# EAGLE design Auto2017 (EAGLE 8.2.2)

## Sheet 1 of 3
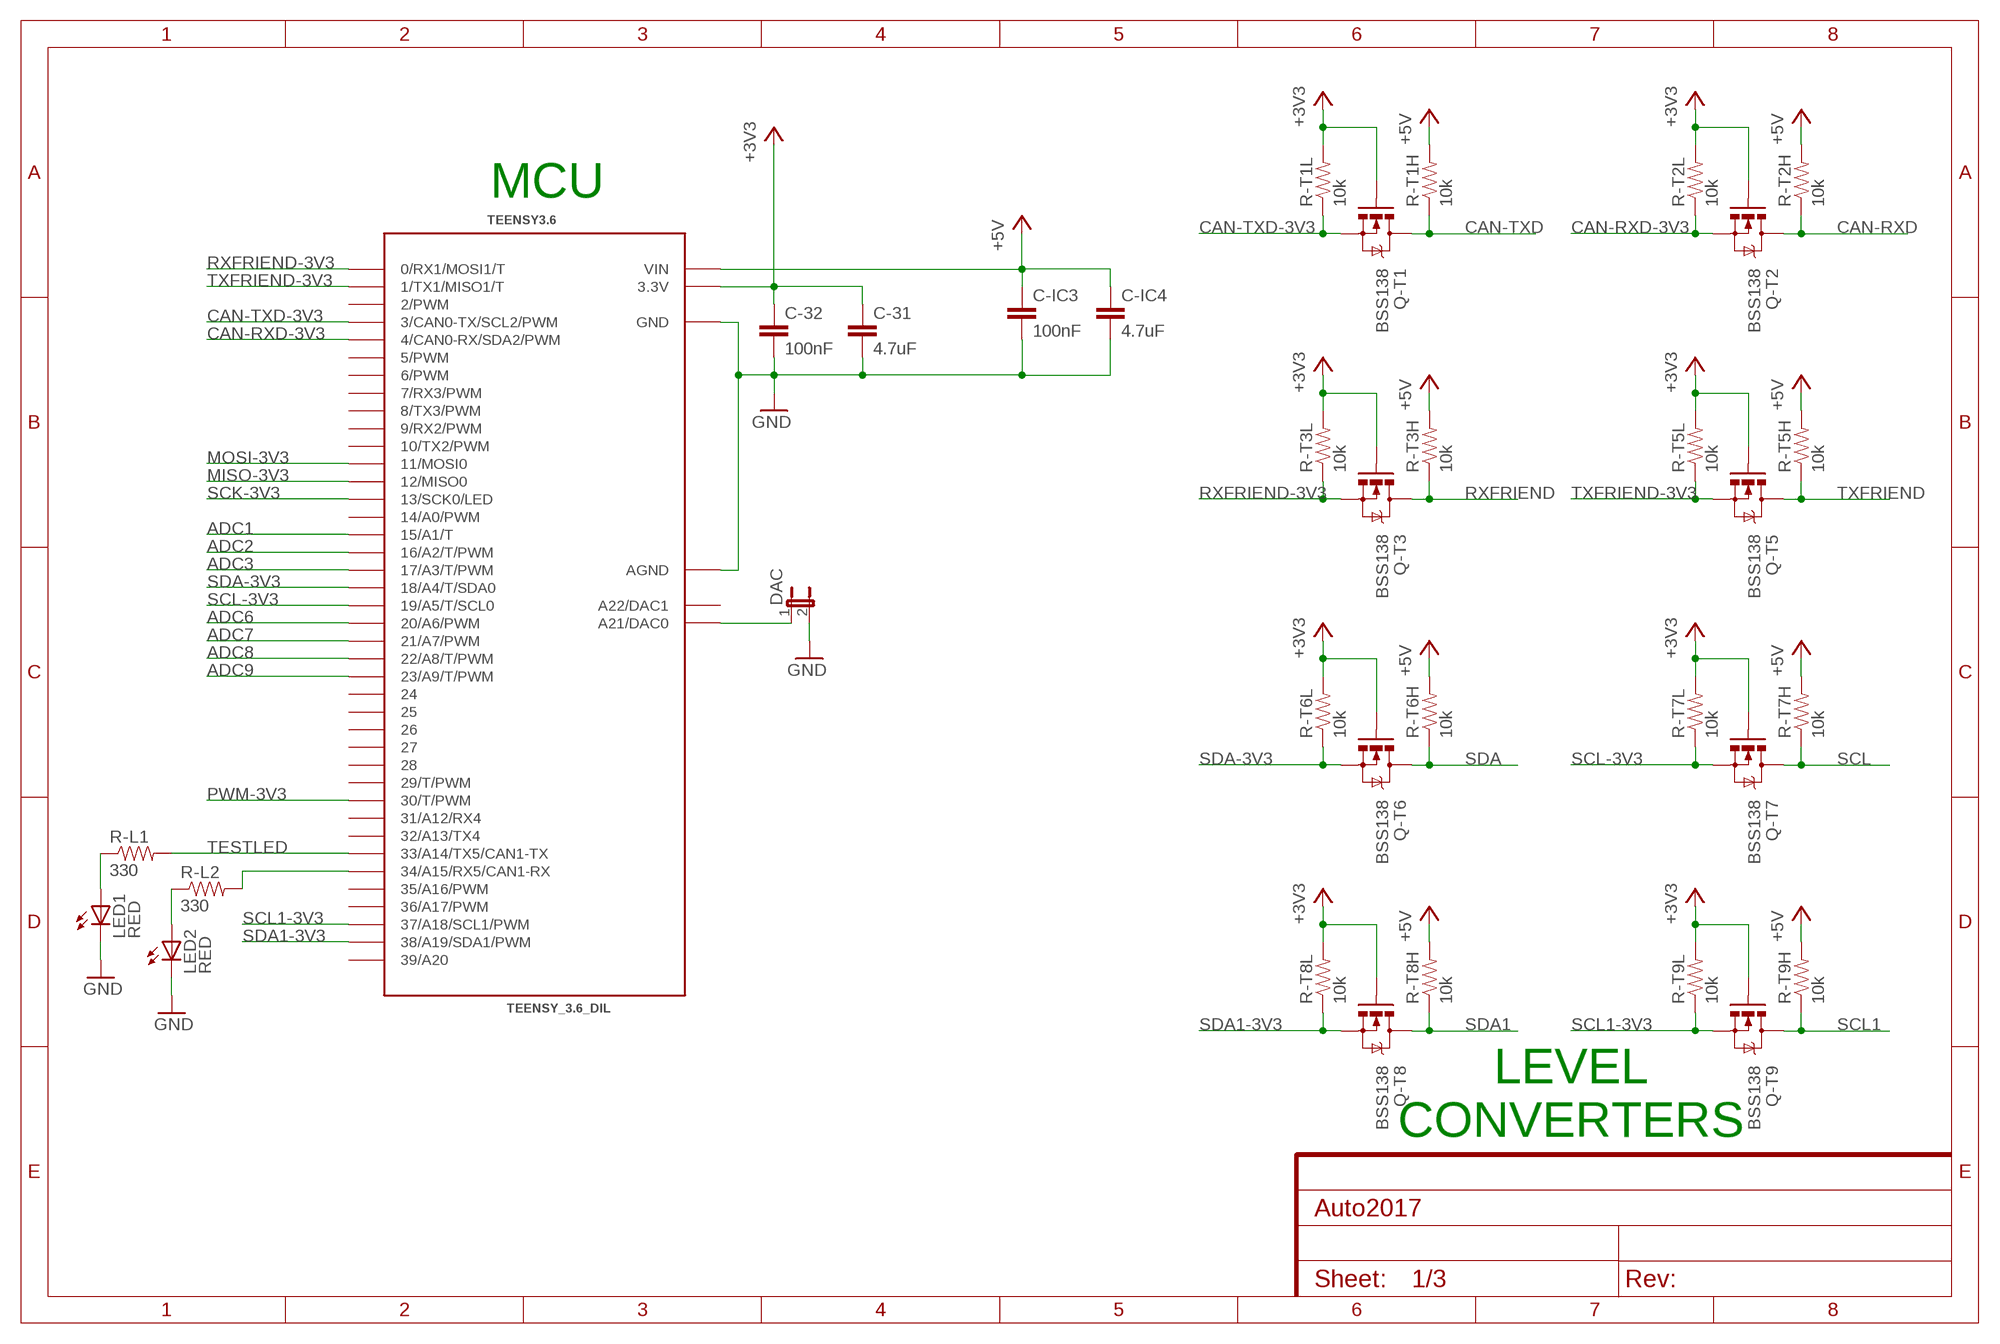
[diagram p0: schematic, sheet 1]
A (FRAME-A4L): CNAME: Auto2017: MCU and Level converters; CREVISION: 2; DESIGNER: Henning

### Parts
C-31  4.7uF  CAP1210  [1210]
C-32  100nF  CAP0805  [0805]
C-IC3  100nF  CAP0805  [0805]
C-IC4  4.7uF  CAP1210  [1210]
DAC  JUMPER-2PTH  [1X02]
LED1  RED  LED1206  [LED-1206]
LED2  RED  LED1206  [LED-1206]
Q-T1  BSS138  MOSFET-NCHANNELBSS123LT1G  [SOT23-3]
Q-T2  BSS138  MOSFET-NCHANNELBSS123LT1G  [SOT23-3]
Q-T3  BSS138  MOSFET-NCHANNELBSS123LT1G  [SOT23-3]
Q-T5  BSS138  MOSFET-NCHANNELBSS123LT1G  [SOT23-3]
Q-T6  BSS138  MOSFET-NCHANNELBSS123LT1G  [SOT23-3]
Q-T7  BSS138  MOSFET-NCHANNELBSS123LT1G  [SOT23-3]
Q-T8  BSS138  MOSFET-NCHANNELBSS123LT1G  [SOT23-3]
Q-T9  BSS138  MOSFET-NCHANNELBSS123LT1G  [SOT23-3]
R-L1  330  RESISTOR0805-RES  [0805]
R-L2  330  RESISTOR0805-RES  [0805]
R-T1H  10k  RESISTOR0805-RES  [0805]
R-T1L  10k  RESISTOR0805-RES  [0805]
R-T2H  10k  RESISTOR0805-RES  [0805]
R-T2L  10k  RESISTOR0805-RES  [0805]
R-T3H  10k  RESISTOR0805-RES  [0805]
R-T3L  10k  RESISTOR0805-RES  [0805]
R-T5H  10k  RESISTOR0805-RES  [0805]
R-T5L  10k  RESISTOR0805-RES  [0805]
R-T6H  10k  RESISTOR0805-RES  [0805]
R-T6L  10k  RESISTOR0805-RES  [0805]
R-T7H  10k  RESISTOR0805-RES  [0805]
R-T7L  10k  RESISTOR0805-RES  [0805]
R-T8H  10k  RESISTOR0805-RES  [0805]
R-T8L  10k  RESISTOR0805-RES  [0805]
R-T9H  10k  RESISTOR0805-RES  [0805]
R-T9L  10k  RESISTOR0805-RES  [0805]
TEENSY3.6  TEENSY_3.6_DIL  [TEENSY_3.6_DIL]

### Nets
+3V3: C-31.1 C-32.1 Q-T1.1(G) Q-T2.1(G) Q-T3.1(G) Q-T5.1(G) Q-T6.1(G) Q-T7.1(G) Q-T8.1(G) Q-T9.1(G) R-T1L.2 R-T2L.2 R-T3L.2 R-T5L.2 R-T6L.2 R-T7L.2 R-T8L.2 R-T9L.2 TEENSY3.6.3.3V TEENSY3.6.3.3V3(3.3V) ; also sheet 3
+5V: C-IC3.1 C-IC4.1 R-T1H.2 R-T2H.2 R-T3H.2 R-T5H.2 R-T6H.2 R-T7H.2 R-T8H.2 R-T9H.2 TEENSY3.6.VIN ; also sheet 2,3
ADC1: TEENSY3.6.15/A1(15/A1/T) ; also sheet 3
ADC2: TEENSY3.6.16/A2(16/A2/T/PWM) ; also sheet 3
ADC3: TEENSY3.6.17/A3(17/A3/T/PWM) ; also sheet 3
ADC6: TEENSY3.6.20/A6(20/A6/PWM) ; also sheet 3
ADC7: TEENSY3.6.21/A7(21/A7/PWM) ; also sheet 3
ADC8: TEENSY3.6.22/A8(22/A8/T/PWM) ; also sheet 3
ADC9: TEENSY3.6.23/A9(23/A9/T/PWM) ; also sheet 3
CAN-RXD: Q-T2.3(D) R-T2H.1 ; also sheet 2
CAN-RXD-3V3: Q-T2.2(S) R-T2L.1 TEENSY3.6.4(4/CAN0-RX/SDA2/PWM)
CAN-TXD: Q-T1.3(D) R-T1H.1 ; also sheet 2
CAN-TXD-3V3: Q-T1.2(S) R-T1L.1 TEENSY3.6.3(3/CAN0-TX/SCL2/PWM)
GND: C-31.2 C-32.2 C-IC3.2 C-IC4.2 DAC.2 LED1.C LED2.C TEENSY3.6.AGND TEENSY3.6.GND TEENSY3.6.GND1(GND) ; also sheet 2,3
MISO-3V3: TEENSY3.6.12(12/MISO0) ; also sheet 3
MOSI-3V3: TEENSY3.6.11(11/MOSI0) ; also sheet 3
N$1: LED1.A R-L1.1
N$2: LED2.A R-L2.1
N$4: R-L2.2 TEENSY3.6.34/A15(34/A15/RX5/CAN1-RX)
N$5: DAC.1 TEENSY3.6.A21(A21/DAC0)
PWM-3V3: TEENSY3.6.30(30/T/PWM) ; also sheet 3
RXFRIEND: Q-T3.3(D) R-T3H.1 ; also sheet 2
RXFRIEND-3V3: Q-T3.2(S) R-T3L.1 TEENSY3.6.0(0/RX1/MOSI1/T)
SCK-3V3: TEENSY3.6.13(13/SCK0/LED) ; also sheet 3
SCL: Q-T7.3(D) R-T7H.1 ; also sheet 2,3
SCL1: Q-T9.3(D) R-T9H.1 ; also sheet 3
SCL1-3V3: Q-T9.2(S) R-T9L.1 TEENSY3.6.37/A18(37/A18/SCL1/PWM)
SCL-3V3: Q-T7.2(S) R-T7L.1 TEENSY3.6.19/A5(19/A5/T/SCL0)
SDA: Q-T6.3(D) R-T6H.1 ; also sheet 2,3
SDA1: Q-T8.3(D) R-T8H.1 ; also sheet 3
SDA1-3V3: Q-T8.2(S) R-T8L.1 TEENSY3.6.38/A19(38/A19/SDA1/PWM)
SDA-3V3: Q-T6.2(S) R-T6L.1 TEENSY3.6.18/A4(18/A4/T/SDA0)
TESTLED: R-L1.2 TEENSY3.6.33/A14(33/A14/TX5/CAN1-TX)
TXFRIEND: Q-T5.3(D) R-T5H.1 ; also sheet 2
TXFRIEND-3V3: Q-T5.2(S) R-T5L.1 TEENSY3.6.1(1/TX1/MISO1/T)
Unconnected: TEENSY3.6.2(2/PWM) TEENSY3.6.5(5/PWM) TEENSY3.6.6(6/PWM) TEENSY3.6.7(7/RX3/PWM) TEENSY3.6.8(8/TX3/PWM) TEENSY3.6.9(9/RX2/PWM) TEENSY3.6.10(10/TX2/PWM) TEENSY3.6.14/A0(14/A0/PWM) TEENSY3.6.24 TEENSY3.6.25 TEENSY3.6.26 TEENSY3.6.27 TEENSY3.6.28 TEENSY3.6.29(29/T/PWM) TEENSY3.6.31/A12(31/A12/RX4) TEENSY3.6.32/A13(32/A13/TX4) TEENSY3.6.35/A16(35/A16/PWM) TEENSY3.6.36/A17(36/A17/PWM) TEENSY3.6.39/A20 TEENSY3.6.A22(A22/DAC1)

### Notes on the sheet
- MCU
- LEVEL
  CONVERTERS

## Sheet 2 of 3
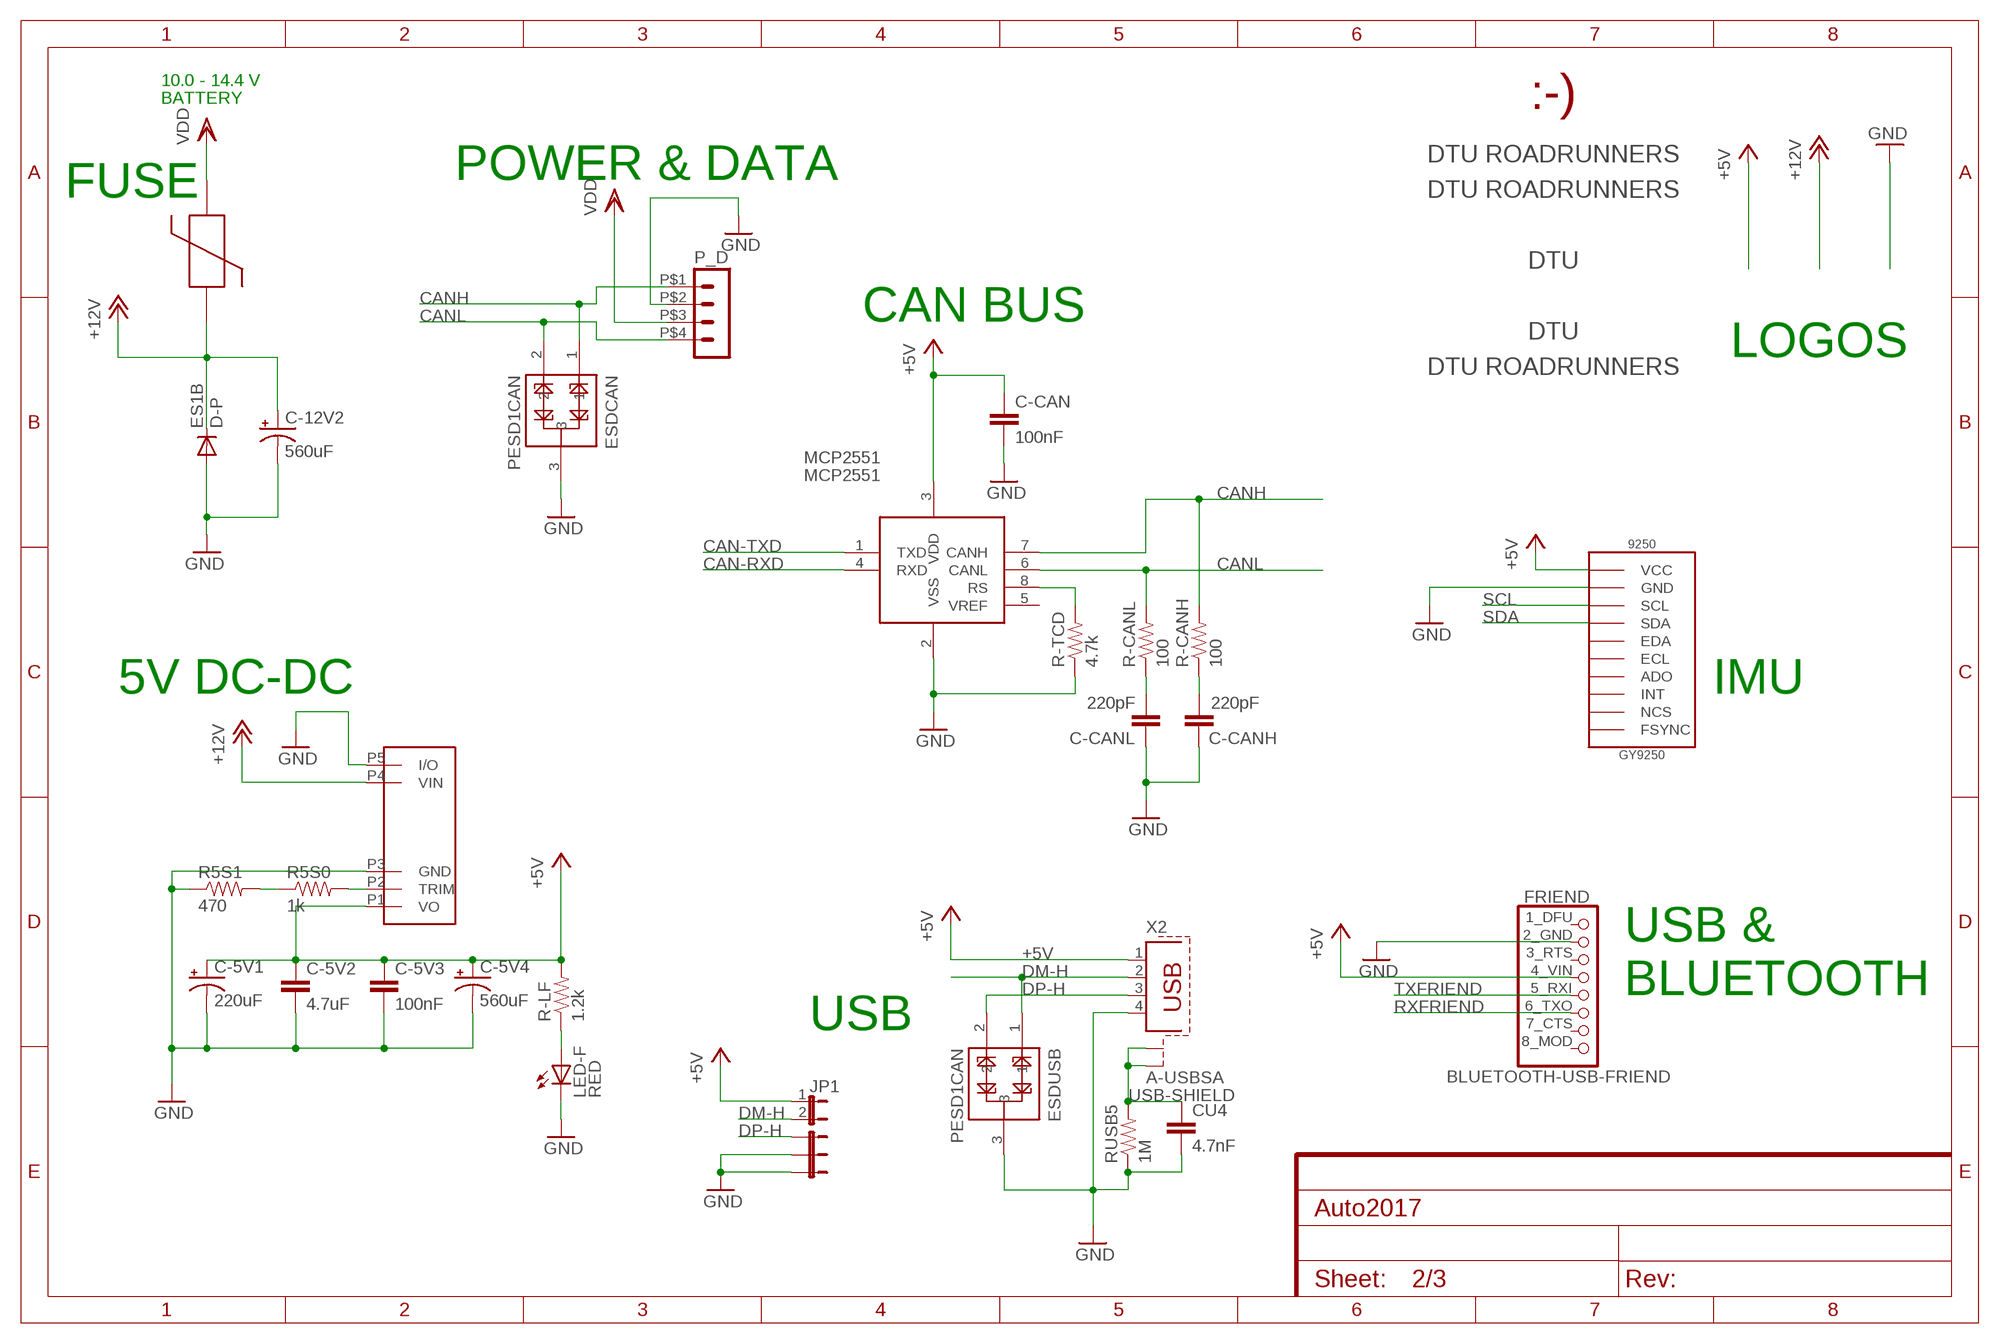
[diagram p1: schematic, sheet 2]
FRAME2 (FRAME-A4L): CNAME: Auto2017: Active components; CREVISION: 2; DESIGNER: Henning

### Parts
9250  GY9250  [GY9250]
C-5V1  220uF  CPOL-USD  [PANASONIC_D]
C-5V2  4.7uF  CAP1210  [1210]
C-5V3  100nF  CAP0805  [0805]
C-5V4  560uF  CPOL-USG  [PANASONIC_G]
C-12V2  560uF  CPOL-USG  [PANASONIC_G]
C-CAN  100nF  CAP0805  [0805]
C-CANH  220pF  CAP0805  [0805]
C-CANL  220pF  CAP0805  [0805]
CU4  4.7nF  CAP0805  [0805]
D-P  ES1B  DIODESMA  [SMA-DIODE]
ESDCAN  PESD1CAN  [SOT23-3]
ESDUSB  PESD1CAN  [SOT23-3]
FRIEND  BLUETOOTH-USB-FRIEND  [1X08_ROUND_76]
JP1  JUMPER-2PTH  [1X02]
JP3  JUMPER-3PTH  [1X03]
LED-F  RED  LED1206  [LED-1206]
MAIN_FUSE  SMF_OMNI-BLOK_FUSE_BLOCK  [SMF_OMNI-BLOK_FUSE_BLOCK]
MCP2551  MCP2551  [SO-08M]
P_D  HEADER_POS4_43045-0401  [43045-0400]
R5S0  1k  RESISTOR0805-RES  [0805]
R5S1  470  RESISTOR0805-RES  [0805]
R-CANH  100  RESISTOR0805-RES  [0805]
R-CANL  100  RESISTOR0805-RES  [0805]
R-LF  1.2k  RESISTOR0805-RES  [0805]
R-TCD  4.7k  RESISTOR0805-RES  [0805]
RUSB5  1M  RESISTOR0805-RES  [0805]
U$1  AXA003A0XZ  [SIP]
U$3  DTUMEDIUM-9MM  [DTU-MEDIUM-9MM]
U$4  ROADRUNNERSFULL  [ROADRUNNERS-FULL]
U$5  ROADRUNNERSSMALL  [ROADRUNNERS-SMALL]
U$6  SMILEY  [SMILEY]
U$8  DTUSMALL  [DTU-SMALL-5MM]
U$9  ROADRUNNERSFULL  [ROADRUNNERS-FULL]
X2  A-USBSA  [USB-A]

### Nets
+5V: 9250.P$VCC(VCC) C-5V1.+ C-5V2.1 C-5V3.1 C-5V4.+ C-CAN.1 FRIEND.4_VIN JP1.1 MCP2551.3(VDD) R-LF.2 U$1.P1(VO) X2.1 ; also sheet 1,3
+12V: C-12V2.+ D-P.C MAIN_FUSE.PIN1 U$1.P4(VIN)
CAN-RXD: MCP2551.4(RXD) ; also sheet 1
CAN-TXD: MCP2551.1(TXD) ; also sheet 1
CANH: ESDCAN.1 MCP2551.7(CANH) P_D.P$1 R-CANH.2
CANL: ESDCAN.2 MCP2551.6(CANL) P_D.P$4 R-CANL.2
DM-H: ESDUSB.1 JP1.2 X2.2
DP-H: ESDUSB.2 JP3.1 X2.3
GND: 9250.P$GND(GND) C-5V1.- C-5V2.2 C-5V3.2 C-5V4.- C-12V2.- C-CAN.2 C-CANH.1 C-CANL.1 CU4.2 D-P.A ESDCAN.3 ESDUSB.3 FRIEND.2_GND JP3.2 JP3.3 LED-F.C MCP2551.2(VSS) P_D.P$2 R5S1.1 R-TCD.1 RUSB5.1 U$1.P3(GND) U$1.P5(I/O) X2.4 ; also sheet 1,3
N$3: R5S0.1 R5S1.2
N$6: R5S0.2 U$1.P2(TRIM)
N$12: LED-F.A R-LF.1
N$25: C-CANL.2 R-CANL.1
N$26: C-CANH.2 R-CANH.1
RS: MCP2551.8(RS) R-TCD.2
RXFRIEND: FRIEND.6_TXO ; also sheet 1
SCL: 9250.P$SCL(SCL) ; also sheet 1,3
SDA: 9250.P$SDA(SDA) ; also sheet 1,3
TXFRIEND: FRIEND.5_RXI ; also sheet 1
USB-SHIELD: CU4.1 RUSB5.2 X2.S1 X2.S2
VDD: MAIN_FUSE.PIN2 P_D.P$3
Unconnected: 9250.P$ADO(ADO) 9250.P$ECL(ECL) 9250.P$EDA(EDA) 9250.P$FSYNC(FSYNC) 9250.P$INT(INT) 9250.P$NCS(NCS) FRIEND.1_DFU FRIEND.3_RTS FRIEND.7_CTS FRIEND.8_MOD MCP2551.5(VREF)

### Notes on the sheet
- 10.0 - 14.4 V
- BATTERY
- POWER & DATA
- FUSE
- CAN BUS
- LOGOS
- 5V DC-DC | IMU
- USB &
  BLUETOOTH
- USB

## Sheet 3 of 3
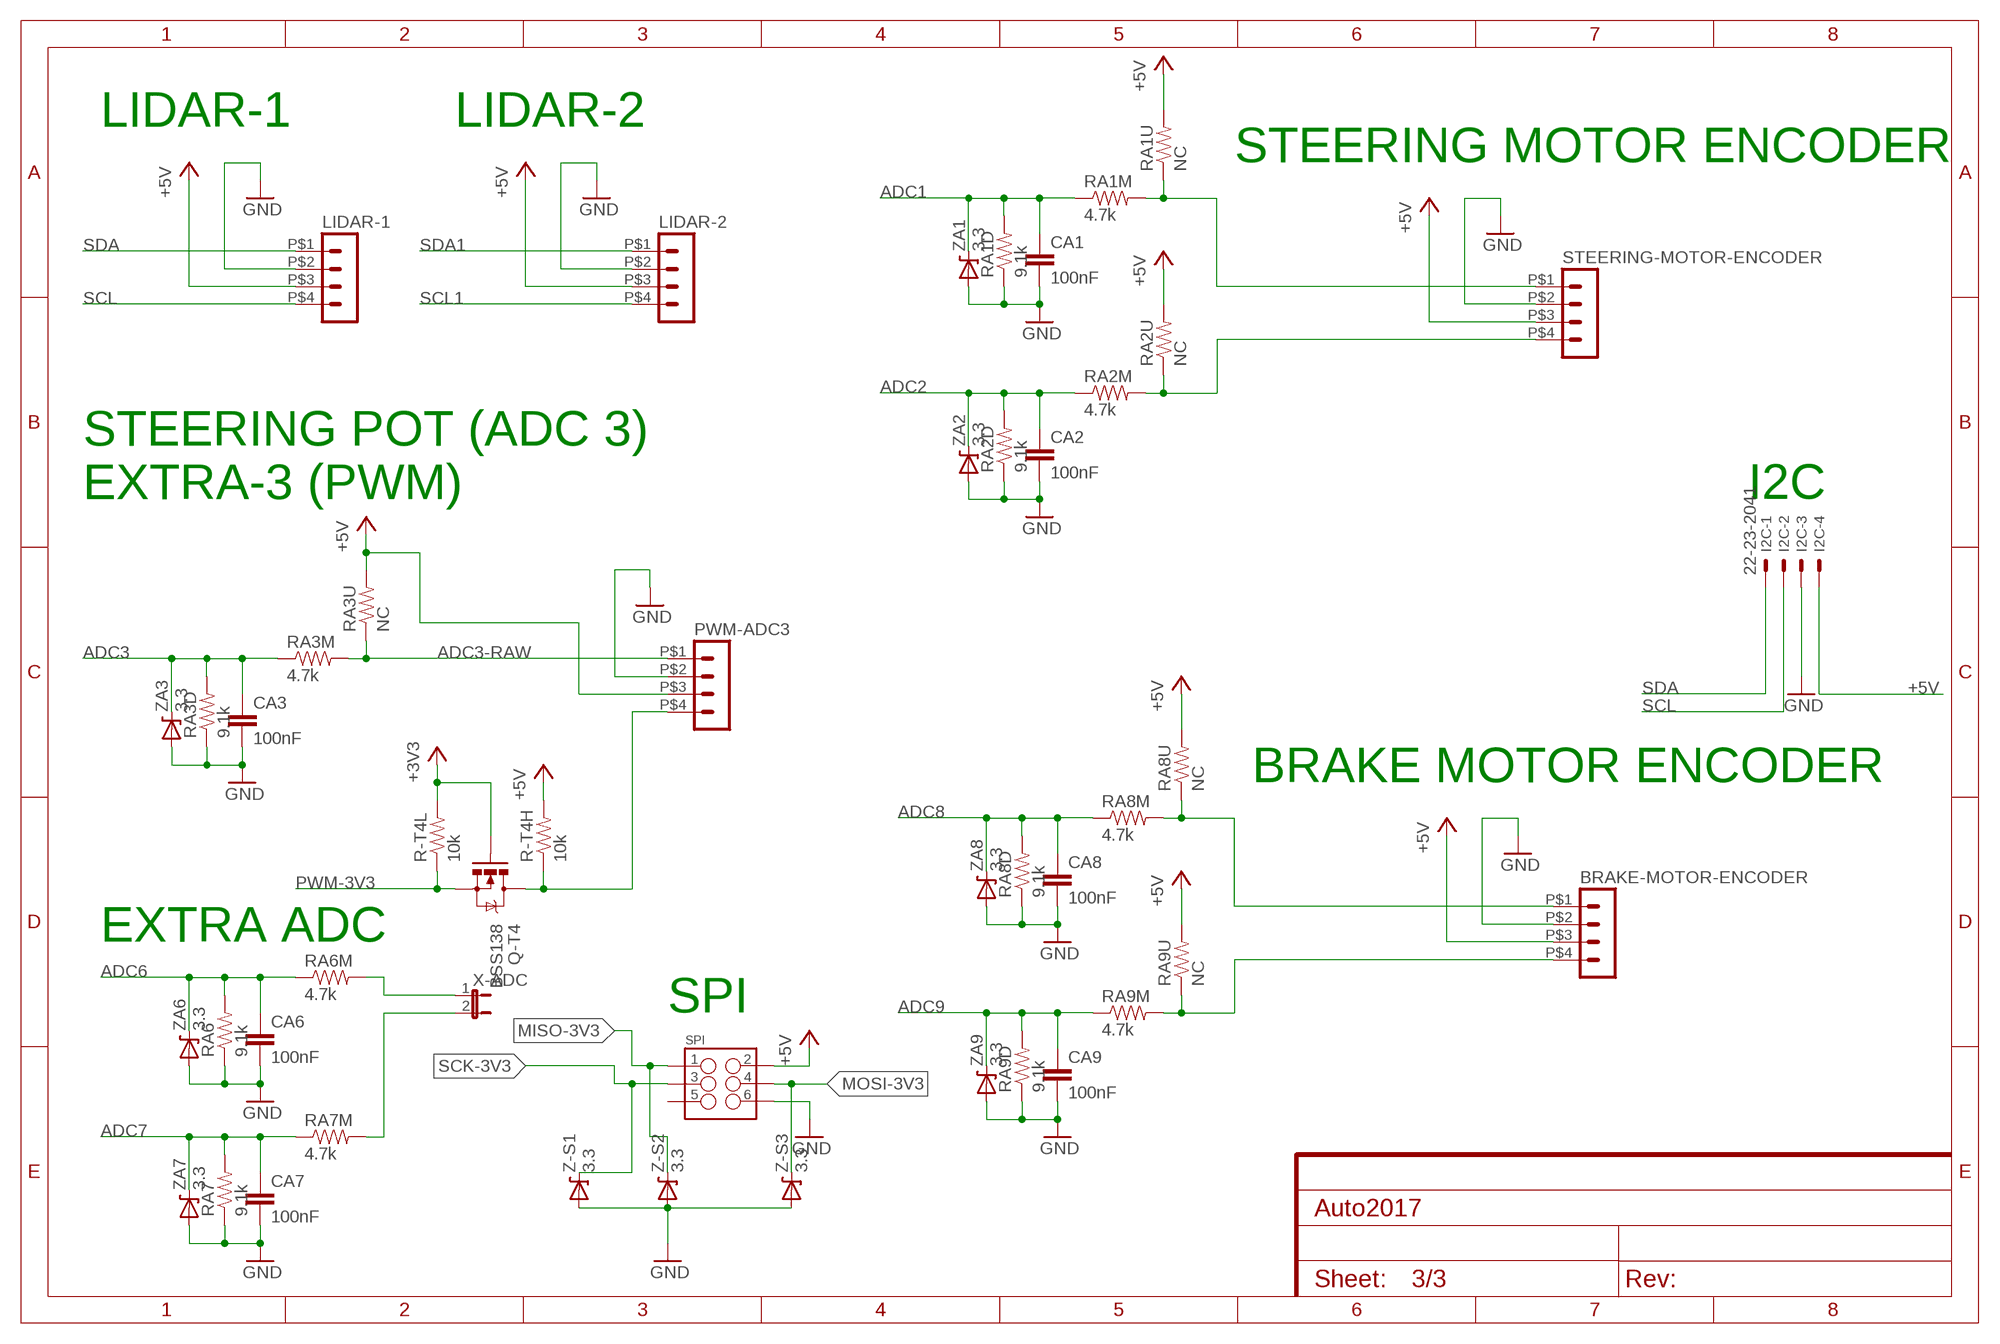
[diagram p2: schematic, sheet 3]
FRAME1 (FRAME-A4L): CNAME: Auto2017: External connections; CREVISION: 2; DESIGNER: Henning

### Parts
BRAKE-MOTOR-ENCODER  HEADER_POS4_43045-0401  [43045-0400]
CA1  100nF  CAP0805  [0805]
CA2  100nF  CAP0805  [0805]
CA3  100nF  CAP0805  [0805]
CA6  100nF  CAP0805  [0805]
CA7  100nF  CAP0805  [0805]
CA8  100nF  CAP0805  [0805]
CA9  100nF  CAP0805  [0805]
I2C  22-23-2041  [22-23-2041]
LIDAR-1  HEADER_POS4_43045-0401  [43045-0400]
LIDAR-2  HEADER_POS4_43045-0401  [43045-0400]
PWM-ADC3  HEADER_POS4_43045-0401  [43045-0400]
Q-T4  BSS138  MOSFET-NCHANNELBSS123LT1G  [SOT23-3]
R-T4H  10k  RESISTOR0805-RES  [0805]
R-T4L  10k  RESISTOR0805-RES  [0805]
RA1D  9.1k  RESISTOR0805-RES  [0805]
RA1M  4.7k  RESISTOR0805-RES  [0805]
RA1U  NC  RESISTOR0805-RES  [0805]
RA2D  9.1k  RESISTOR0805-RES  [0805]
RA2M  4.7k  RESISTOR0805-RES  [0805]
RA2U  NC  RESISTOR0805-RES  [0805]
RA3D  9.1k  RESISTOR0805-RES  [0805]
RA3M  4.7k  RESISTOR0805-RES  [0805]
RA3U  NC  RESISTOR0805-RES  [0805]
RA6  9.1k  RESISTOR0805-RES  [0805]
RA6M  4.7k  RESISTOR0805-RES  [0805]
RA7  9.1k  RESISTOR0805-RES  [0805]
RA7M  4.7k  RESISTOR0805-RES  [0805]
RA8D  9.1k  RESISTOR0805-RES  [0805]
RA8M  4.7k  RESISTOR0805-RES  [0805]
RA8U  NC  RESISTOR0805-RES  [0805]
RA9D  9.1k  RESISTOR0805-RES  [0805]
RA9M  4.7k  RESISTOR0805-RES  [0805]
RA9U  NC  RESISTOR0805-RES  [0805]
SPI  M03X2POGO_PINS  [2X3_POGO]
STEERING-MOTOR-ENCODER  HEADER_POS4_43045-0401  [43045-0400]
X-ADC  JUMPER-2PTH  [1X02]
Z-S1  3.3  ZENER  [SOD123]
Z-S2  3.3  ZENER  [SOD123]
Z-S3  3.3  ZENER  [SOD123]
ZA1  3.3  ZENER  [SOD123]
ZA2  3.3  ZENER  [SOD123]
ZA3  3.3  ZENER  [SOD123]
ZA6  3.3  ZENER  [SOD123]
ZA7  3.3  ZENER  [SOD123]
ZA8  3.3  ZENER  [SOD123]
ZA9  3.3  ZENER  [SOD123]

### Nets
+3V3: Q-T4.1(G) R-T4L.2 ; also sheet 1
+5V: BRAKE-MOTOR-ENCODER.P$3 I2C.4 LIDAR-1.P$3 LIDAR-2.P$3 PWM-ADC3.P$3 R-T4H.2 RA1U.2 RA2U.2 RA3U.2 RA8U.2 RA9U.2 SPI.P$2 STEERING-MOTOR-ENCODER.P$3 ; also sheet 1,2
ADC1: CA1.1 RA1D.2 RA1M.1 ZA1.C ; also sheet 1
ADC1-RAW: RA1M.2 RA1U.1 STEERING-MOTOR-ENCODER.P$1
ADC2: CA2.1 RA2D.2 RA2M.1 ZA2.C ; also sheet 1
ADC2-RAW: RA2M.2 RA2U.1 STEERING-MOTOR-ENCODER.P$4
ADC3: CA3.1 RA3D.2 RA3M.1 ZA3.C ; also sheet 1
ADC3-RAW: PWM-ADC3.P$1 RA3M.2 RA3U.1
ADC6: CA6.1 RA6.2 RA6M.1 ZA6.C ; also sheet 1
ADC6-RAW: RA6M.2 X-ADC.1
ADC7: CA7.1 RA7.2 RA7M.1 ZA7.C ; also sheet 1
ADC7-RAW: RA7M.2 X-ADC.2
ADC8: CA8.1 RA8D.2 RA8M.1 ZA8.C ; also sheet 1
ADC8-RAW: BRAKE-MOTOR-ENCODER.P$1 RA8M.2 RA8U.1
ADC9: CA9.1 RA9D.2 RA9M.1 ZA9.C ; also sheet 1
ADC9-RAW: BRAKE-MOTOR-ENCODER.P$4 RA9M.2 RA9U.1
GND: BRAKE-MOTOR-ENCODER.P$2 CA1.2 CA2.2 CA3.2 CA6.2 CA7.2 CA8.2 CA9.2 I2C.3 LIDAR-1.P$2 LIDAR-2.P$2 PWM-ADC3.P$2 RA1D.1 RA2D.1 RA3D.1 RA6.1 RA7.1 RA8D.1 RA9D.1 SPI.P$6 STEERING-MOTOR-ENCODER.P$2 Z-S1.A Z-S2.A Z-S3.A ZA1.A ZA2.A ZA3.A ZA6.A ZA7.A ZA8.A ZA9.A ; also sheet 1,2
MISO-3V3: SPI.P$1 Z-S2.C ; also sheet 1
MOSI-3V3: SPI.P$4 Z-S3.C ; also sheet 1
PWM-3V3: Q-T4.2(S) R-T4L.1 ; also sheet 1
PWM-5V: PWM-ADC3.P$4 Q-T4.3(D) R-T4H.1
SCK-3V3: SPI.P$3 Z-S1.C ; also sheet 1
SCL: I2C.2 LIDAR-1.P$4 ; also sheet 1,2
SCL1: LIDAR-2.P$4 ; also sheet 1
SDA: I2C.1 LIDAR-1.P$1 ; also sheet 1,2
SDA1: LIDAR-2.P$1 ; also sheet 1
Unconnected: SPI.P$5

### Notes on the sheet
- LIDAR-1 | LIDAR-2
- STEERING MOTOR ENCODER
- STEERING POT (ADC 3)
  EXTRA-3 (PWM)
- I2C
- BRAKE MOTOR ENCODER
- EXTRA ADC
- SPI

## Library data of the parts
9250 = GY9250:GY9250: GY9250/6500 MPU-9250 module (3 axis accelerator, 3 axis gyro and 3 axis magnetometer) Chip: MPU9250; Power voltage: 3~5V Communication mode: I2C / SPI; Gyro range: +/-250, +/-500, +/-1000, +/-2000dps Accelerator range: +/-2G, +/-4G, +/-8G, +/-16G Magnetometer range: +/-4800uF Pin spacing: 2.54mm Bought from AliExpress <https://www.aliexpress.com/item/SPI-IIC-MPU-9250-9-Axis-Attitude-Gyro-Accelerator-Magnetometer-Sensor-Module/1893522629.html>
BRAKE-MOTOR-ENCODER LIDAR-1 LIDAR-2 P_D PWM-ADC3 STEERING-MOTOR-ENCODER = con-molex-micro-fit-3_0:HEADER_POS4_?: Molex - Micro-Fit 3.0 Series connector, 3.00mm (0.118") pitch header, 4 positions.
C-5V1 C-5V4 C-12V2 = rcl:CPOL-US: POLARIZED CAPACITOR, American symbol
C-5V2 C-5V3 C-31 C-32 C-CAN C-CANH C-CANL C-IC3 C-IC4 CA1-CA3 CA6-CA9 CU4 = SparkFun-Passives:CAP: Capacitor Standard 0603 ceramic capacitor, and 0.1" leaded capacitor.
D-P = SparkFun-DiscreteSemi:DIODE: Diode These are standard reverse protection diodes and small signal diodes. SMA package can handle up to about 1A. SOD-323 can handle about 200mA. What the SOD-323 package when ordering, there are some mfgs out there that are 5-pin packages.
DAC JP1 X-ADC = SparkFun-Retired:JUMPER-2: Jumper Basic 0.1" spaced jumper. Use with breakaway headers.
ESDCAN ESDUSB = SparkFun-DiscreteSemi:PESD1CAN: PESD1CAN is used to protect two automotive CAN bus lines from ESD.; PROD_ID: DIO-12501
FRIEND = BluetoothAndUSBFriend:BLUETOOTH-USB-FRIEND
I2C = con-molex:22-23-2041: .100" (2.54mm) Center Header - 4 Pin; MF: MOLEX; MPN: 22-23-2041; OC_FARNELL: 1462920; OC_NEWARK: 38C0355
JP3 = SparkFun-Retired:JUMPER-3
LED1 LED2 LED-F = SparkFun-LED:LED: LEDs Standard schematic elements and footprints for 5mm, 3mm, 1206, and 0603 sized LEDs. 5mm - Spark Fun Electronics SKU : COM-00529 (and others)
MAIN_FUSE = SMF_OMNI-BLOK_FUSE_BLOCK:SMF_OMNI-BLOK_FUSE_BLOCK
MCP2551 = skpang_lib:MCP2551
Q-T1-Q-T9 = SparkFun-DiscreteSemi:MOSFET-NCHANNEL: Common NMOSFET Parts MFG P/N Store ID Prod ID FDD8780 TRANS-09984 SI7820DN TRANS-11055 FDS6630A IC-08089 2N7002PW TRANS-11151 FQP30N06L COM-10213 TRANS-10060 BSS123LT1G TRANS-08345 BSS138 TRANS-00830 BS170 2N7000; PROD_ID: TRANS-08345
R5S0 R5S1 R-CANH R-CANL R-L1 R-L2 R-LF R-T1H R-T1L R-T2H R-T2L R-T3H R-T3L R-T4H R-T4L R-T5H R-T5L R-T6H R-T6L R-T7H R-T7L R-T8H R-T8L R-T9H R-T9L R-TCD RA1D RA1M RA1U RA2D RA2M RA2U RA3D RA3M RA3U RA6 RA6M RA7 RA7M RA8D RA8M RA8U RA9D RA9M RA9U RUSB5 = SparkFun-Resistors:RESISTOR: Resistor Basic schematic elements and footprints for 0603, 1206, and PTH resistors.
SPI = SparkFun-Connectors:M03X2: 2x3 .1" header. Shrouded, with keying- CONN-10681 SMT- CONN-11415 Pogo pins- HW-11044; PROD_ID: HW-11044
TEENSY3.6 = Teensy_3_and_LC_Series_Boards_v1.4:TEENSY_3.6_DIL: Teensy 3.6 DIL Package
U$1 = Austin-MiniLynx-DC-DC:AXA003A0XZ: Lineage Power Austin MiniLynx DC-DC Ikke-isoleret DC-DC-konverter, Udgang: 0.75 → 5.5V dc, Udgangsstrøm: 3A RS-varenummer:152-524 Fabrikant: Lineage Power Producentens varenummer: AXA003A0XZ
U$3 U$8 = Logos:DTU
U$4 U$5 U$9 = Logos:ROADRUNNERS
U$6 = Logos:SMILEY
X2 = AssmannUSB:A-USBSA
Z-S1-Z-S3 ZA1-ZA3 ZA6-ZA9 = diodes:ZENER

## Board
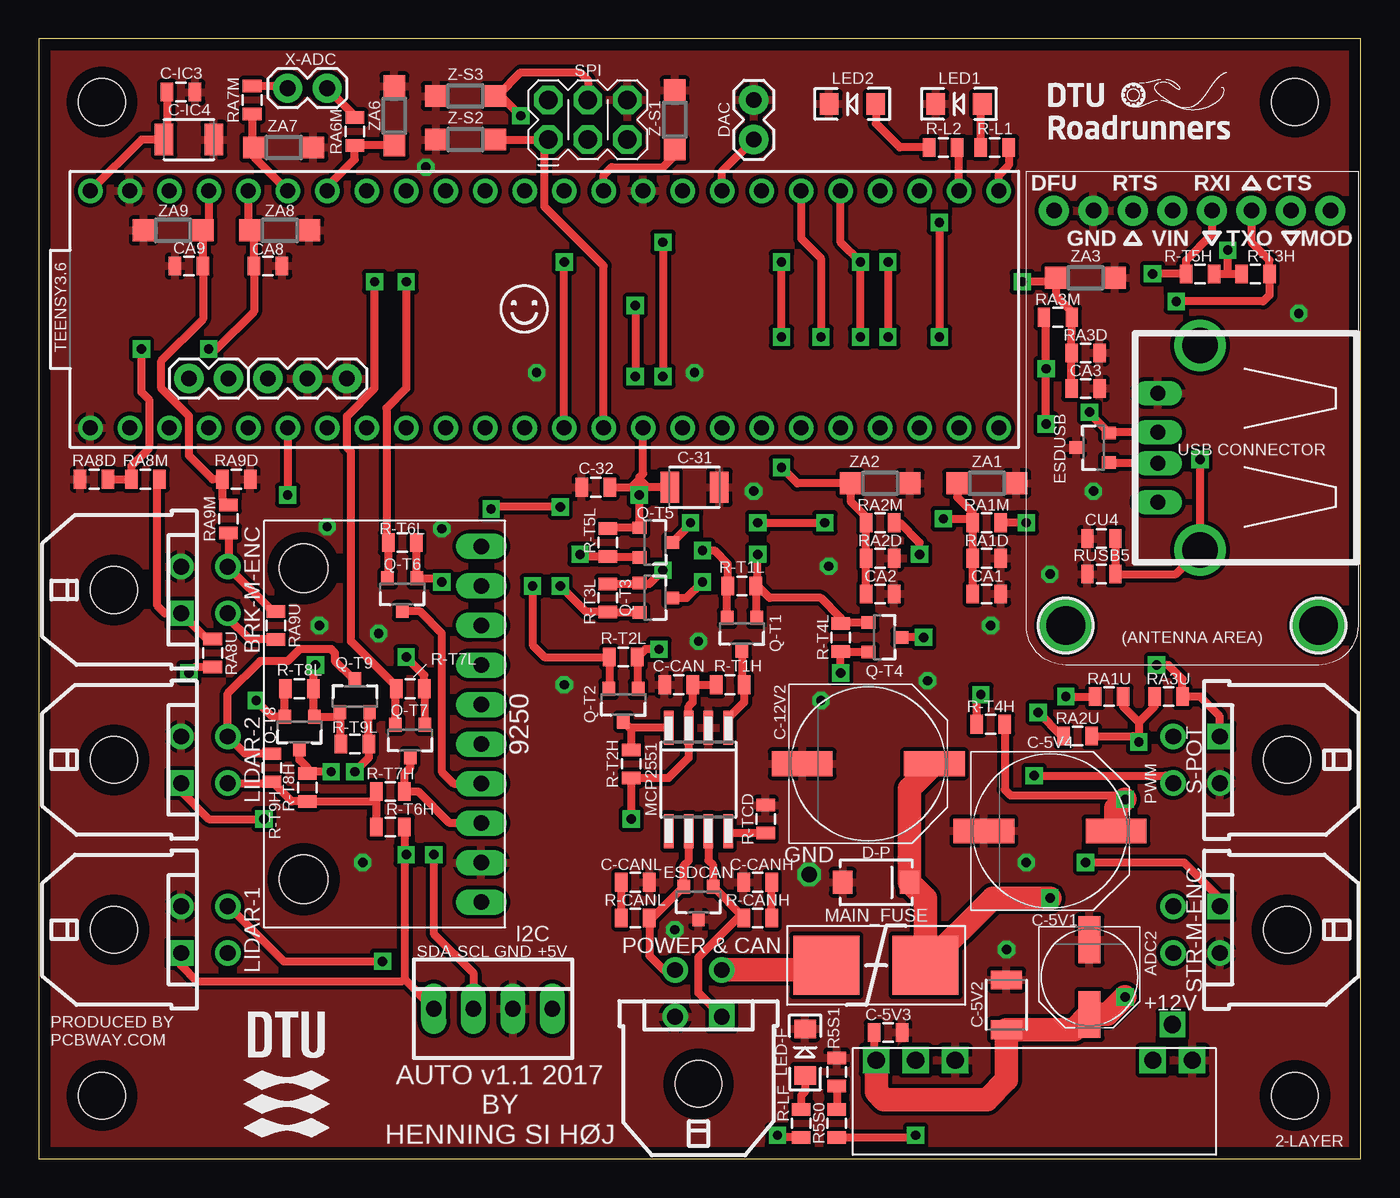
[diagram p3: board, top side]
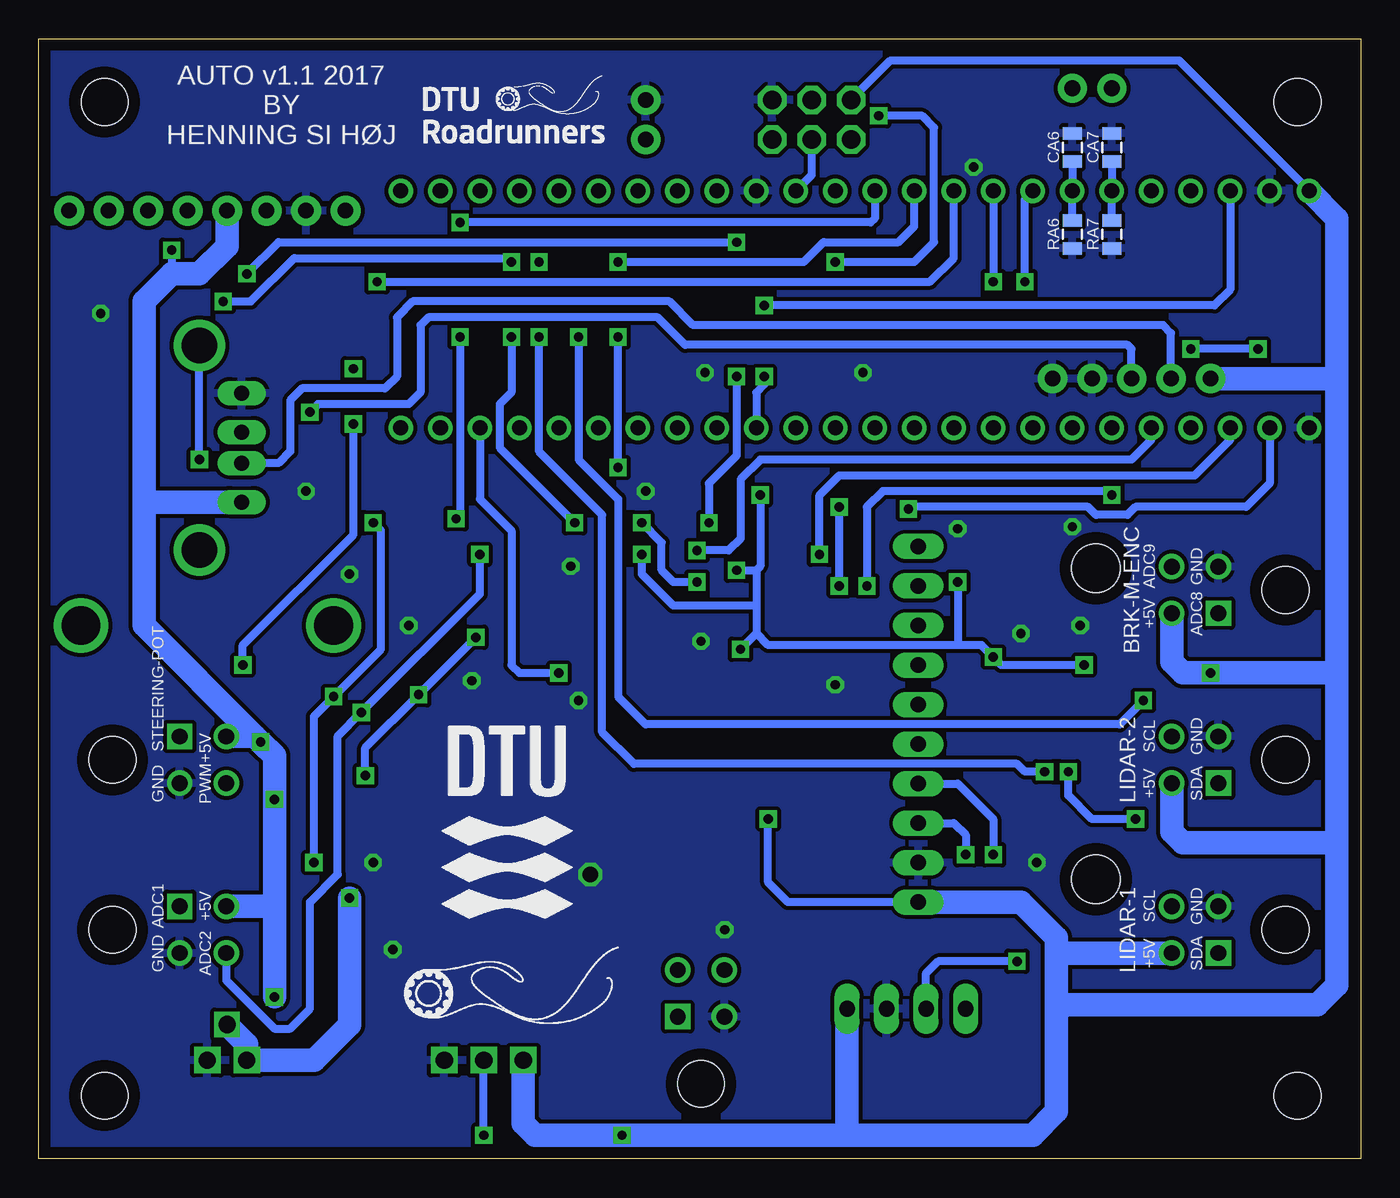
[diagram p4: board, bottom side, seen from below]

Size 85 x 72 mm. Coordinates in mm from the lower left corner, seen from the top.
Outline: 0,0 85,0 85,72 0,72 0,0
Copper layers (1*16): Top 0.035mm / dielectric 1.5mm / Bottom 0.035mm
Design rules "CustomSparkFun2Layer *": minimum track width 16mil, minimum drill 20mil, track to track 10mil, track to pad 8mil, pad to pad 8mil, via to via 8mil, smd to smd 8mil, copper to edge 30mil, drill to drill 8mil, minimum pad ring 12mil, minimum via ring 10mil, stop-mask expansion 4mil, vias tented up to drill 25mil, thermal gap 10mil
Holes 3 mm at 4.06,67.94 80.77,67.94 80.77,4.06 4.06,4.06

### Footprints (pad centres in the part's own frame; a part is rotated, then mirrored left to right if it is on the bottom)
GY9250 = drill 1.016 long: P$ADO 3.81,-6.35; P$ECL -1.27,-6.35; P$EDA 1.27,-6.35; P$FSYNC 11.43,-6.35; P$GND -8.89,-6.35; P$INT 6.35,-6.35; P$NCS 8.89,-6.35; P$SCL -6.35,-6.35; P$SDA -3.81,-6.35; P$VCC -11.43,-6.35 | hole 3.1: -9.97,5.08; 10.03,5.08
43045-0400 = drill 1.02 square: P$1 1.5,4.32 | drill 1.02: P$2 -1.5,4.32; P$3 1.5,7.32; P$4 -1.5,7.32 | hole 3: 0,0
PANASONIC_D = smd 3 x 1.4: + 2.4,0; - -2.4,0
1210 = smd 1.2 x 2: 1 -1.6,0; 2 1.6,0
0805 = smd 0.8 x 1.2: 1 -0.9,0; 2 0.9,0
PANASONIC_G = smd 3.9 x 1.6: + 4.25,0; - -4.25,0
SMA-DIODE = smd 1.27 x 1.47: A -2.15,0; C 2.15,0
1X02 = drill 1.016 pad 1.88: 1 0,0; 2 2.54,0
SOT23-3 = smd 0.8 x 0.9: 1 -0.95,-1; 2 0.95,-1; 3 0,1.1
1X08_ROUND_76 = drill 1 pad 1.93: 1_DFU 19.558,2.54; 2_GND 17.018,2.54; 3_RTS 14.478,2.54; 4_VIN 11.938,2.54; 5_RXI 9.398,2.54; 6_TXO 6.858,2.54; 7_CTS 4.318,2.54; 8_MOD 1.778,2.54 | drill 2.5 pad 3.2: P$1 2.54,29.21; P$2 18.796,29.21
22-23-2041 = drill 1 long: 1 -3.81,0; 2 -1.27,0; 3 1.27,0; 4 3.81,0
1X03 = drill 1.016 pad 1.88: 1 0,0; 2 2.54,0; 3 5.08,0
LED-1206 = smd 1.2 x 1.4: A -1.5,0; C 1.5,0
SMF_OMNI-BLOK_FUSE_BLOCK = smd 4.242 x 3.81: PIN1 -3.175,0; PIN2 3.2,0
SO-08M = smd 0.6 x 2.2: 1 -1.905,-3.33; 2 -0.635,-3.33; 3 0.635,-3.33; 4 1.905,-3.33; 5 1.905,3.33; 6 0.635,3.33; 7 -0.635,3.33; 8 -1.905,3.33
2X3_POGO = drill 1.2 pad 1.829 octagon: P$1 0,0; P$2 0,2.54; P$3 2.54,0; P$4 2.54,2.54; P$5 5.08,0; P$6 5.08,2.54
TEENSY_3.6_DIL = drill 0.965: 0 -7.62,25.4; 1 -7.62,22.86; 2 -7.62,20.32; 3 -7.62,17.78; 3.3V 7.62,22.86; 3.3V3 -7.62,-7.62; 4 -7.62,15.24; 5 -7.62,12.7; 6 -7.62,10.16; 7 -7.62,7.62; 8 -7.62,5.08; 9 -7.62,2.54; 10 -7.62,0; 11 -7.62,-2.54; 12 -7.62,-5.08; 13 7.62,-5.08; 14/A0 7.62,-2.54; 15/A1 7.62,0; 16/A2 7.62,2.54; 17/A3 7.62,5.08; 18/A4 7.62,7.62; 19/A5 7.62,10.16; 20/A6 7.62,12.7; 21/A7 7.62,15.24; 22/A8 7.62,17.78; 23/A9 7.62,20.32; 24 -7.62,-10.16; 25 -7.62,-12.7; 26 -7.62,-15.24; 27 -7.62,-17.78; 28 -7.62,-20.32; 29 -7.62,-22.86; 30 -7.62,-25.4; 31/A12 -7.62,-27.94; 32/A13 -7.62,-30.48; 33/A14 7.62,-30.48; 34/A15 7.62,-27.94; 35/A16 7.62,-25.4; 36/A17 7.62,-22.86; 37/A18 7.62,-20.32; 38/A19 7.62,-17.78; 39/A20 7.62,-15.24; A21 7.62,-12.7; A22 7.62,-10.16; AGND 7.62,25.4; GND -7.62,27.94; GND1 7.62,-7.62; VIN 7.62,27.94
SIP = drill 1.1 pad 1.626 square: P1 10.414,-3.048; P2 7.874,-3.048; P3 5.334,-3.048; P4 -7.366,-3.048; P5 -9.906,-3.048
USB-A = drill 0.95 long: 1 -3.5,2.71; 2 -1,2.71; 3 1,2.71; 4 3.5,2.71 | drill 2.3 pad 2.9: S1 -6.57,0; S2 6.57,0
SOD123 = smd 1.4 x 1.4: A 1.9,0; C -1.9,0

### Placement (x,y rotation side)
9250  22.1,27.94 90 top
BRAKE-MOTOR-ENCODER  4.83,36.58 270 top
C-5V1  67.56,11.68 270 top
C-5V2  62.23,9.91 90 top
C-5V3  54.61,8.13 0 top
C-5V4  65.02,21.08 0 top
C-12V2  53.34,25.4 0 top
C-31  42.16,43.18 0 top
C-32  35.81,43.18 180 top
C-CAN  41.15,30.48 180 top
C-CANH  46.23,17.78 0 top
C-CANL  38.35,17.78 180 top
C-IC3  9.14,68.58 0 top
C-IC4  9.65,65.53 0 top
CA1  60.96,36.32 0 top
CA2  54.1,36.32 0 top
CA3  67.31,49.53 0 top
CA6  18.54,65.02 90 bottom
CA7  16,65.02 90 bottom
CA8  14.73,57.4 0 top
CA9  9.65,57.4 180 top
CU4  68.33,39.88 180 top
D-P  53.85,17.78 0 top
DAC  45.97,65.53 90 top
ESDCAN  42.42,16.51 180 top
ESDUSB  67.82,45.72 90 top
FRIEND  84.84,63.5 180 top
I2C  29.21,9.65 0 top
JP1  9.65,50.16 0 top
JP3  14.73,50.16 0 top
LED1  59.18,67.82 180 top
LED2  52.32,67.82 180 top
LED-F  49.28,6.86 90 top
LIDAR-1  4.83,14.73 270 top
LIDAR-2  4.83,25.65 270 top
MAIN_FUSE  53.85,12.45 180 top
MCP2551  42.42,24.38 180 top
P_D  42.42,4.83 0 top
PWM-ADC3  80.26,25.65 90 top
Q-T1  45.21,33.78 180 top
Q-T2  37.59,29.21 180 top
Q-T3  39.62,36.07 270 top
Q-T4  54.36,33.53 270 top
Q-T5  39.62,39.62 270 top
Q-T6  23.37,36.32 180 top
Q-T7  23.88,26.92 180 top
Q-T8  16.76,27.43 180 top
Q-T9  20.32,29.72 0 top
R5S0  51.31,2.29 270 top
R5S1  51.31,5.59 270 top
R-CANH  46.23,15.49 180 top
R-CANL  38.35,15.49 0 top
R-L1  61.47,65.02 0 top
R-L2  58.17,65.02 0 top
R-LF  49.02,2.29 270 top
R-T1H  44.45,30.48 180 top
R-T1L  45.21,36.83 0 top
R-T2H  38.1,25.4 270 top
R-T2L  37.59,32.26 0 top
R-T3H  78.23,56.9 180 top
R-T3L  36.58,36.07 90 top
R-T4H  61.21,27.94 0 top
R-T4L  51.56,33.53 90 top
R-T5H  74.68,56.9 0 top
R-T5L  36.58,39.62 90 top
R-T6H  22.61,21.34 180 top
R-T6L  23.37,39.62 0 top
R-T7H  22.61,23.62 180 top
R-T7L  23.88,30.23 0 top
R-T8H  17.27,23.88 270 top
R-T8L  16.76,30.23 0 top
R-T9H  14.99,25.15 270 top
R-T9L  20.32,26.67 180 top
R-TCD  46.74,21.84 270 top
RA1D  60.96,38.61 180 top
RA1M  60.96,40.89 0 top
RA1U  68.83,29.72 0 top
RA2D  54.1,38.61 180 top
RA2M  54.1,40.89 0 top
RA2U  66.8,27.18 0 top
RA3D  67.31,51.82 180 top
RA3M  65.53,54.1 180 top
RA3U  72.64,29.72 180 top
RA6  18.54,59.44 90 bottom
RA6M  20.32,66.04 90 top
RA7  16,59.44 90 bottom
RA7M  13.72,68.07 90 top
RA8D  3.56,43.69 0 top
RA8M  6.86,43.69 0 top
RA8U  11.18,32.51 270 top
RA9D  12.7,43.69 180 top
RA9M  12.19,41.15 270 top
RA9U  15.24,34.29 270 top
RUSB5  68.33,37.59 0 top
SPI  32.77,65.53 0 top
STEERING-MOTOR-ENCODER  80.26,14.73 90 top
TEENSY3.6  31.24,54.61 90 top
U$1  64.26,3.3 180 top
U$3  54.86,22.35 0 bottom
U$4  70.87,67.82 0 top
U$5  54.61,11.18 0 bottom
U$6  31.24,54.61 0 top
U$8  16,6.1 0 top
U$9  54.36,67.56 0 bottom
X2  74.68,45.72 90 top
X-ADC  18.54,68.83 180 top
Z-S1  40.89,66.8 90 top
Z-S2  27.43,65.53 180 top
Z-S3  27.43,68.33 180 top
ZA1  60.96,43.43 0 top
ZA2  54.1,43.43 0 top
ZA3  67.31,56.64 0 top
ZA6  22.86,67.06 90 top
ZA7  15.75,65.02 0 top
ZA8  15.49,59.69 0 top
ZA9  8.64,59.69 180 top

### Tracks (layer width: path | path; a pad name or v marks a point on that pad's centre or on a via)
+3V3  (via drill 0.6)
  Top 0.508: Q-T7.1 24.83,30.18 R-T7L.2 24.78,31.1 v23.62,32.26 | Q-T2.1 38.49,30.26 R-T2L.2 39,32.77 v39.88,32.77 | 36.63,37.02 R-T3L.2 38.61,36.97 | R-T5L.2 36.63,40.57 Q-T5.1 38.62,42.15 | 38.62,43.69 38.62,43.82 38.86,44.06 TEENSY3.6.3.3V3 | Q-T1.1 46.16,36.78 | 46.16,36.78 R-T1L.2 46.23,36.95 | Q-T4.1 51.61,34.48 R-T4L.2 51.56,34.8 50.29,36.07 46.99,36.07 46.28,36.78 | v38.35,54.86 v38.35,50.29 | C-32.1 38.12,43.18 38.62,43.69 | C-31.1 39.13,43.18 38.62,43.69 | 38.61,36.97 39.25,36.97 v40.13,37.85 | 46.28,36.78 46.23,36.83 v46.23,38.86 | 38.62,42.15 v38.61,42.67 | 38.62,42.15 38.62,43.69 | Q-T3.1 38.62,36.98 38.61,36.97 | 46.16,36.78 46.28,36.78 | R-T9L.2 19.42,28.67 Q-T9.1 19.08,28.43 Q-T8.1 17.66,28.48 R-T8L.2 17.66,31.63 v17.78,31.75 | R-T6L.2 24.27,37.37 Q-T6.1 25.67,37.32 v25.91,37.08
  Bottom 0.508: TEENSY3.6.3.3V 8.38,55.88 9.4,54.86 v38.35,54.86 | v38.35,50.29 38.35,49.78 38.86,49.28 TEENSY3.6.3.3V3 | 38.86,35.56 44.2,35.56 46.23,37.59 v46.23,38.86 | 38.86,37.85 38.86,35.56 | 38.86,35.56 38.86,33.78 | 38.86,33.78 v39.88,32.77 | v40.13,37.85 38.86,37.85 | v38.61,42.67 38.61,38.1 38.86,37.85 | 25.91,33.02 24.38,33.02 v23.62,32.26 23.11,31.75 v17.78,31.75 | 25.91,33.02 38.1,33.02 38.86,33.78 | v25.91,37.08 25.91,33.02
+5V  (via drill 0.6)
  Top 0.508: R-T5H.2 76.45,56.9 | 76.45,56.9 R-T3H.2 | R-T1H.2 C-CAN.1 42.05,29.35 41.78,29.08 MCP2551.3 41.78,25.78 40.5,24.5 R-T2H.2 v38.1,21.84 | C-5V3.1 53.71,6.49 U$1.P1 | R-LF.2 47.89,1.39 v47.5,1.52 | C-IC3.1 8.24,65.72 C-IC4.1 6.6,65.53 TEENSY3.6.VIN | 70.74,28.07 v70.74,26.8 70.36,27.18 RA2U.2 | RA3U.2 71.74,29.07 70.74,28.07 | RA1U.2 69.73,29.07 70.74,28.07 | 76.45,56.9 v76.45,58.42 | R-T4H.2 62.11,23.74 62.48,23.37 69.6,23.37 v69.85,23.11 | LIDAR-2.P$3 14.89,24.15 R-T9H.2 16.26,22.98 R-T8H.2 21.57,22.98 21.71,23.11 | RA9U.2 13.55,33.39 12.15,34.8 BRAKE-MOTOR-ENCODER.P$3 | RA8U.2 10.02,31.61 v9.65,31.24 | R-T6H.2 21.71,23.11 | 21.71,23.11 R-T7H.2
  Top 1.524: U$1.P1 53.85,4.32 54.36,3.81 60.96,3.81 62.23,5.08 C-5V2.1 66.59,8.31 C-5V1.+ 68.72,9.28 v69.85,10.41 | C-5V4.+ 69.27,22.54 v69.85,23.11
  Bottom 0.508: TEENSY3.6.VIN 11.68,70.61 30.23,70.61 SPI.P$2 | 9250.P$VCC 36.83,16.51 38.1,17.78 v38.1,21.84 | v76.45,58.42 76.45,56.9
  Bottom 1.524: v69.85,10.41 69.85,16.26 | 69.85,16.26 v69.85,23.11 69.85,25.91 v70.74,26.8 71.12,27.18 | 71.12,27.18 72.92,27.18 PWM-ADC3.P$3 | 71.12,27.18 78.23,34.29 78.23,42.42 | 78.23,42.42 78.23,55.12 76.45,56.9 74.68,56.9 72.9,58.67 FRIEND.4_VIN | X2.1 78.03,42.22 78.23,42.42 | 19.56,12.95 19.56,9.4 | 19.56,9.4 19.56,3.05 21.08,1.52 33.27,1.52 | 33.27,1.52 v47.5,1.52 53.09,1.52 53.85,2.29 U$1.P1 | 19.56,12.95 19.56,14.22 21.84,16.51 9250.P$VCC | LIDAR-1.P$3 19.28,13.23 19.56,12.95 | LIDAR-2.P$3 12.15,21.04 11.43,20.32 1.52,20.32 | 1.52,20.32 1.52,11.18 2.79,9.91 19.05,9.91 19.56,9.4 | 1.52,20.32 1.52,31.24 | 1.52,31.24 1.52,49.78 | 1.52,49.78 1.52,60.45 TEENSY3.6.VIN | I2C.4 33.02,1.78 33.27,1.52 | JP1.1 1.91,50.16 1.52,49.78 | 1.52,31.24 v9.65,31.24 11.43,31.24 12.15,31.96 BRAKE-MOTOR-ENCODER.P$3 | STEERING-MOTOR-ENCODER.P$3 69.87,16.23 69.85,16.26
+12V  (via drill 0.6, 1.1)
  Top 1.524: v65.02,16.76 61.34,16.76 MAIN_FUSE.PIN1 57.02,16.75 D-P.C 56,23.81 C-12V2.+
  Bottom 1.524: v65.02,16.76 65.02,8.64 67.31,6.35 U$1.P4 71.63,7.37 v72.9,8.64
ADC1  (via drill 0.6)
  Top 0.508: RA1M.1 60.06,41.54 59.06,42.54 ZA1.C | RA1M.1 RA1D.2 CA1.1 | v57.91,60.2 v57.91,52.83 | v58.17,41.15 59.81,41.15 RA1M.1
  Bottom 0.508: TEENSY3.6.15/A1 31.24,60.45 31.5,60.2 v57.91,60.2 | v57.91,52.83 57.91,41.4 v58.17,41.15
ADC1-RAW  (via drill 0.6)
  Top 0.508: STEERING-MOTOR-ENCODER.P$1 75.94,16.77 73.66,19.05 v67.31,19.05 | v66.04,29.72 RA1U.1 | v63.5,40.89 RA1M.2
  Bottom 0.508: v67.31,19.05 67.31,28.45 v66.04,29.72 62.99,32.77 62.99,40.39 v63.5,40.89
ADC2  (via drill 0.6)
  Top 0.508: CA2.1 RA2D.2 RA2M.1 53.2,41.29 52.2,42.29 ZA2.C 48.77,43.43 v47.75,44.45 | v47.75,52.83 v47.75,57.66
  Bottom 0.508: v47.75,44.45 v47.75,52.83 | v47.75,57.66 35.81,57.66 34.54,58.93 29.72,58.93 28.7,59.94 TEENSY3.6.16/A2
ADC2-RAW  (via drill 0.6)
  Top 0.508: RA2U.1 65.79,27.18 v64.26,28.7 | v56.64,38.86 56.64,39.62 55.37,40.89 RA2M.2
  Bottom 0.508: STEERING-MOTOR-ENCODER.P$4 72.94,11.48 69.85,8.38 68.83,8.38 67.56,9.65 67.56,16.51 65.79,18.29 65.79,27.18 v64.26,28.7 56.64,36.32 v56.64,38.86
ADC3  (via drill 0.6)
  Top 0.508: CA3.1 RA3D.2 RA3M.1 66.41,54.49 65.41,55.49 ZA3.C 65.28,56.64 65.02,56.39 v63.25,56.39
  Bottom 0.508: v63.25,56.39 27.69,56.39 26.16,57.91 TEENSY3.6.17/A3
ADC3-RAW  (via drill 0.6)
  Top 0.508: PWM-ADC3.P$1 75.94,28.45 74.68,29.72 RA3U.1 73.54,30.85 72.64,31.75 v71.88,31.75 | v64.77,47.24 v64.77,50.8 64.77,53.96 RA3M.2
  Bottom 0.508: v71.88,31.75 71.88,33.02 64.77,40.13 v64.77,47.24
ADC6
  Top 0.508: ZA6.C 20.34,65.16 RA6M.1 20.32,64.26 18.54,62.48 TEENSY3.6.20/A6
  Bottom 0.508: RA6.2 TEENSY3.6.20/A6 CA6.1
ADC6-RAW
  Top 0.508: RA6M.2 20.32,67.06 X-ADC.1
ADC7
  Top 0.508: TEENSY3.6.21/A7 13.85,64.38 ZA7.C 13.72,65.16 RA7M.1
  Bottom 0.508: RA7.2 TEENSY3.6.21/A7 CA7.1
ADC7-RAW
  Top 0.508: RA7M.2 15.86,68.97 X-ADC.2
ADC8  (via drill 0.6)
  Top 0.508: TEENSY3.6.22/A8 13.46,59.82 ZA8.C 13.83,59.45 CA8.1 13.83,54.47 11.43,52.07 v10.92,52.07 | RA8D.2 RA8M.1 5.96,44.57 7.11,45.72 7.11,48.77 6.6,49.28 v6.6,52.07
  Bottom 0.508: v6.6,52.07 v10.92,52.07
ADC8-RAW
  Top 0.508: RA8M.2 7.62,43.55 7.62,35.56 8.1,35.08 BRAKE-MOTOR-ENCODER.P$1 10.81,33.41 RA8U.1
ADC9
  Top 0.508: TEENSY3.6.23/A9 10.92,60.08 ZA9.C 10.55,59.67 CA9.1 10.55,53.99 7.87,51.31 7.87,49.53 9.65,47.75 9.65,45.21 11.18,43.69 RA9D.2 11.8,42.44 RA9M.1
ADC9-RAW
  Top 0.508: RA9M.2 12.19,38.12 BRAKE-MOTOR-ENCODER.P$4 15.03,35.19 RA9U.1
CAN-RXD
  Top 0.508: MCP2551.4 38.1,27.71 | 38.1,27.71 37.99,27.71 Q-T2.3 | R-T2H.1 38.1,27.71
CAN-RXD-3V3  (via drill 0.6)
  Top 0.508: Q-T2.2 36.69,30.26 R-T2L.1 32.51,32.26 31.75,33.02 v31.75,36.83 | TEENSY3.6.4 v16,42.67
  Bottom 0.508: v16,42.67 16.26,42.93 30.73,42.93 31.75,41.91 v31.75,36.83
CAN-TXD
  Top 0.508: MCP2551.1 44.32,28.32 45.35,29.35 R-T1H.1 45.21,30.62 Q-T1.3
CAN-TXD-3V3  (via drill 0.6)
  Top 0.508: Q-T1.2 44.26,36.78 R-T1L.1 44.31,38.24 43.43,39.12 v42.67,39.12
  Bottom 0.508: TEENSY3.6.3 13.46,46.23 14.73,44.96 38.61,44.96 39.88,43.69 39.88,39.88 40.64,39.12 v42.67,39.12
CANH
  Top 0.508: MCP2551.7 43.05,19.18 43.37,18.86 ESDCAN.1 45.33,15.55 R-CANH.2 44.96,15.49 42.42,12.95 42.42,10.67 43.92,9.17 P_D.P$1
CANL
  Top 0.508: MCP2551.6 41.78,19.18 41.47,18.86 ESDCAN.2 39.45,15.49 R-CANL.2 39.25,13.07 40.18,12.15 P_D.P$4
DM-H
  Top 0.508: X2.2 68.87,44.72 ESDUSB.1
  Bottom 0.508: JP1.2 12.19,53.09 12.7,53.59 42.93,53.59 44.45,55.12 60.96,55.12 61.98,54.1 61.98,50.29 62.74,49.53 68.07,49.53 68.83,48.77 68.83,45.48 69.6,44.72 X2.2
DP-H  (via drill 0.6)
  Top 0.508: X2.3 68.87,46.72 ESDUSB.2 67.56,47.92 v67.56,48.01
  Bottom 0.508: JP3.1 14.73,52.07 14.99,52.32 43.43,52.32 45.21,54.1 59.94,54.1 60.45,53.59 60.45,49.28 61.21,48.51 67.06,48.51 v67.56,48.01
GND  (via drill 0.6, 1)
  other vias: 40.89,14.73 25.91,40.51 18.54,40.64 32,50.55 42.16,50.55 67.82,42.93 50.8,38.1 50.29,29.46 61.21,34.29 42.42,33.27 33.78,30.48 62.23,13.46 63.5,19.05 65.02,37.59 81.03,54.36 49.53,18.29 57.15,30.73 20.83,19.05 21.84,33.78 18.03,34.29 24.89,63.75 45.97,42.93
  pour Top: -2.54,75.69 91.19,75.69 91.19,-4.83 -2.54,-4.83
  pour Bottom: -2.54,75.69 91.19,75.69 91.19,-4.83 -2.54,-4.83
MISO-3V3
  Top 0.508: Z-S2.C SPI.P$1 32.51,65.28 32.51,61.21 36.32,57.4 TEENSY3.6.12
MOSI-3V3  (via drill 0.6)
  Top 0.508: SPI.P$4 35.31,69.34 34.8,69.85 30.99,69.85 29.59,68.45 Z-S3.C 29.72,68.33 v30.99,67.06 | TEENSY3.6.11 v33.78,57.66
  Bottom 0.508: v33.78,57.66 28.7,57.66 27.43,58.93 27.43,66.29 28.19,67.06 v30.99,67.06
N$1
  Top 0.508: R-L1.1 60.57,67.7 LED1.A
N$2
  Top 0.508: R-L2.1 55.37,65.02 53.82,66.57 LED2.A
N$3
  Top 0.508: R5S1.2 R5S0.1
N$4
  Top 0.508: TEENSY3.6.34/A15 59.18,64.91 R-L2.2
N$5
  Top 0.508: TEENSY3.6.A21 43.94,63.5 DAC.1
N$6  (via drill 0.6)
  Top 0.508: R5S0.2 56.25,1.39 v56.39,1.52
  Bottom 0.508: v56.39,1.52 U$1.P2
N$12
  Top 0.508: LED-F.A 49.28,4.32 49.02,4.06 R-LF.1
N$25
  Top 0.508: R-CANL.1 C-CANL.2
N$26
  Top 0.508: R-CANH.1 C-CANH.2
PWM-3V3  (via drill 0.6)
  Top 0.508: Q-T4.2 51.61,32.58 R-T4L.1 v51.56,31.24
  Bottom 0.508: TEENSY3.6.30 56.64,42.42 54.61,40.39 54.61,31.75 54.1,31.24 v51.56,31.24
PWM-5V  (via drill 0.6)
  Top 0.508: 55.37,33.61 Q-T4.3 v56.9,33.53 | v64.01,24.64 72.46,24.64 PWM-ADC3.P$4 | R-T4H.1 60.31,29.58 v60.58,29.84
  Bottom 0.508: v64.01,24.64 64.01,26.42 v60.58,29.84 60.2,30.23 v56.9,33.53
RS
  Top 0.508: R-TCD.2 44.32,20.94 MCP2551.8
RXFRIEND  (via drill 0.6)
  Top 0.508: FRIEND.6_TXO 77.98,58.93 79.13,57.77 R-T3H.1 79.13,55.51 78.74,55.12 v73.15,55.12 | v54.61,57.66 v54.61,52.83 | Q-T3.3 41.66,36.07 v42.67,37.08 | v46.23,40.89 v50.55,40.89
  Bottom 0.508: v73.15,55.12 71.37,55.12 68.58,57.91 54.86,57.91 v54.61,57.66 | v54.61,52.83 54.61,49.28 55.37,48.51 55.37,45.72 v50.55,40.89 | v42.67,37.08 44.2,37.08 44.96,37.85 44.96,39.62 v46.23,40.89
RXFRIEND-3V3  (via drill 0.6)
  Top 0.508: Q-T3.2 36.63,35.12 R-T3L.1 35.19,35.17 v33.53,36.83 | v33.53,41.91 29.21,41.91 v29.08,41.78
  Bottom 0.508: TEENSY3.6.0 5.84,43.43 7.37,41.91 14.48,41.91 14.99,41.4 17.02,41.4 17.53,41.91 28.96,41.91 v29.08,41.78 | v33.53,36.83 v33.53,41.91
SCK-3V3
  Top 0.508: TEENSY3.6.13 36.32,63.25 36.83,63.75 40.13,63.75 40.89,64.52 Z-S1.C
  Bottom 0.508: SPI.P$3 35.31,63.25 TEENSY3.6.13
SCL  (via drill 0.6)
  Top 0.508: Q-T7.3 23.88,25.15 23.51,24.78 R-T7H.1 24.38,23.62 26.42,21.59 9250.P$SCL | v25.4,19.56 25.4,14.48 27.94,11.94 I2C.2 | LIDAR-1.P$4 12.22,16.23 15.75,12.7 v22.1,12.7
  Bottom 0.508: 9250.P$SCL 26.16,21.59 25.4,20.83 v25.4,19.56 | v22.1,12.7 27.18,12.7 27.94,11.94 I2C.2
SCL1
  Top 0.508: Q-T9.3 20.24,30.82 19.05,32 19.05,32.51 18.8,32.77 16.76,32.77 16,32 14.22,32 12.15,29.93 LIDAR-2.P$4 13.25,26.05 R-T9H.1
SCL1-3V3  (via drill 0.6)
  Top 0.508: v52.83,52.83 v52.83,57.66 51.56,58.93 TEENSY3.6.37/A18 | Q-T9.2 21.22,28.67 R-T9L.1 21.22,25.79 v20.32,24.89
  Bottom 0.508: v52.83,52.83 52.83,45.47 48.77,41.4 48.77,27.43 46.74,25.4 22.1,25.4 21.59,24.89 v20.32,24.89 | v52.83,57.66 52.83,57.4
SCL-3V3  (via drill 0.6)
  Top 0.508: R-T7L.1 22.93,30.18 Q-T7.2 22.93,30.41 20.07,33.27 20.07,45.47 19.81,45.72 19.81,47.75 21.59,49.53 v21.59,56.39
  Bottom 0.508: v21.59,56.39 21.59,61.72 TEENSY3.6.19/A5
SDA  (via drill 0.6)
  Top 0.508: R-T6H.1 23.51,19.81 | 23.51,19.81 23.51,11.55 | 23.51,11.55 I2C.1 | LIDAR-1.P$1 9.15,12.44 10.16,11.43 23.39,11.43 23.51,11.55 | v23.62,19.56 23.51,19.81 | 9250.P$SDA 26.67,24.13 25.91,24.89 25.91,33.78 24.47,35.22 Q-T6.3
  Bottom 0.508: 9250.P$SDA 25.91,24.13 23.62,21.84 v23.62,19.56
SDA1  (via drill 0.6)
  Top 0.508: Q-T8.3 16.76,25.65 17.27,25.15 R-T8H.1 17.39,24.89 v18.8,24.89 | LIDAR-2.P$1 9.15,23.62 10.92,21.84 v14.48,21.84
  Bottom 0.508: v14.48,21.84 17.27,21.84 18.8,23.37 v18.8,24.89
SDA1-3V3  (via drill 0.6)
  Top 0.508: TEENSY3.6.38/A19 49.02,59.18 50.29,57.91 v50.29,52.83 | R-T8L.1 15.81,30.18 Q-T8.2 15,28.43 v13.97,29.46
  Bottom 0.508: v50.29,52.83 50.29,44.96 47.75,42.42 47.75,29.72 45.97,27.94 15.49,27.94 v13.97,29.46
SDA-3V3  (via drill 0.6)
  Top 0.508: v23.62,56.39 23.62,49.53 22.35,48.26 22.35,39.74 R-T6L.1 22.47,37.37 Q-T6.2
  Bottom 0.508: TEENSY3.6.18/A4 v23.62,56.39
TESTLED
  Top 0.508: TEENSY3.6.33/A14 61.72,63.25 62.37,63.89 R-L1.2
TXFRIEND  (via drill 0.6)
  Top 0.508: FRIEND.5_RXI 75.44,59.44 73.78,57.77 R-T5H.1 v71.63,56.9 | v40.13,58.93 v40.13,50.29 | v41.91,40.89 41.91,40.81 Q-T5.3
  Bottom 0.508: v71.63,56.9 69.6,58.93 v40.13,58.93 | v40.13,50.29 40.13,45.21 41.91,43.43 v41.91,40.89
TXFRIEND-3V3  (via drill 0.6)
  Top 0.508: Q-T5.2 36.63,38.67 R-T5L.1 34.94,38.72 v34.8,38.86
  Bottom 0.508: v34.8,38.86 34.8,42.67 33.53,43.94 10.67,43.94 8.38,46.23 TEENSY3.6.1
USB-SHIELD  (via drill 0.6)
  Top 0.508: CU4.1 RUSB5.2 73.12,37.59 X2.S1 v74.68,44.96
  Bottom 0.508: v74.68,44.96 X2.S2
VDD
  Top 1.524: P_D.P$3 50.35,12.15 MAIN_FUSE.PIN2

### Text on the board
tPlace: BRK-M-ENC | __ | LIDAR-2 | S-POT | PWM | GND | LIDAR-1 | STR-M-ENC | SDA | SCL | GND | +5V | POWER & CAN | ADC2 | +12V | PRODUCED BY / PCBWAY.COM | AUTO v1.1 2017 / BY / HENNING SI HØJ | 2-LAYER
bPlace: AUTO v1.1 2017 / BY / HENNING SI HØJ | GND | ADC9 | BRK-M-ENC | ADC8 | +5V | STEERING-POT | GND | SCL | LIDAR-2 | +5V | SDA | +5V | PWM | GND | GND | SCL | +5V | ADC1 | LIDAR-1 | SDA | +5V | ADC2 | GND
Measures: _